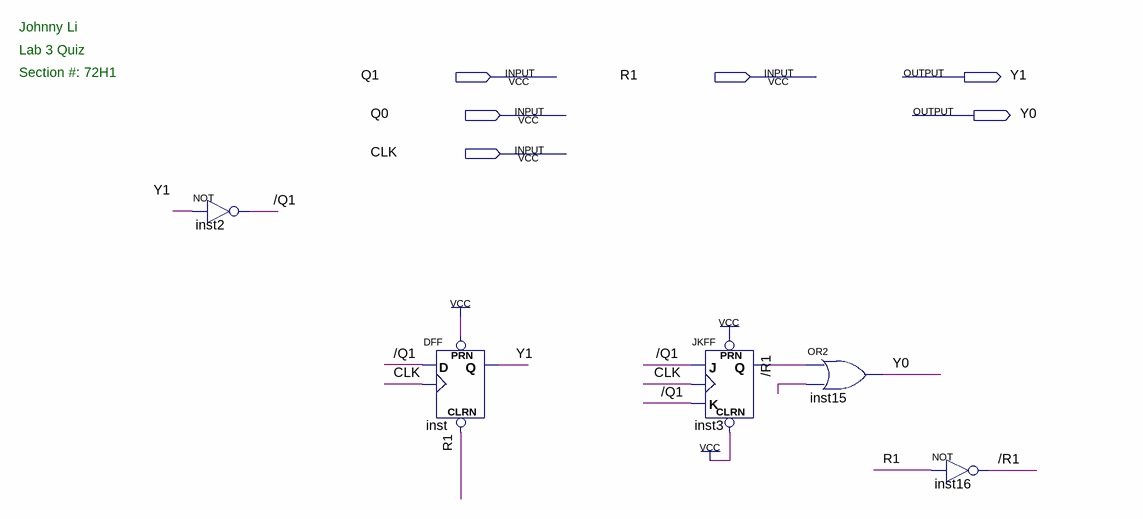
[diagram p0: schematic sheet]
// Quartus schematic lab3quiz.bdf as structural Verilog: 5 symbols, 6 pins
module lab3quiz (
  input  Q1,
  input  R1,
  input  Q0,
  input  CLK,
  output Y1,
  output Y0
);

  wire \/Q1 , \/R1 , inst3_q;

  not inst2 (\/Q1 , Y1);
  DFF inst (.CLRN(R1), .CLK(CLK), .D(\/Q1 ), .PRN(1'b1), .Q(Y1));
  JKFF inst3 (.PRN(1'b1), .CLRN(1'b1), .K(\/Q1 ), .J(\/Q1 ), .CLK(CLK), .Q(inst3_q));
  or inst15 (Y0, inst3_q, \/R1 );
  not inst16 (\/R1 , R1);

  // Notes on the sheet:
  //   Johnny Li 
  //   Lab 3 Quiz
  //   Section #: 72H1
endmodule
